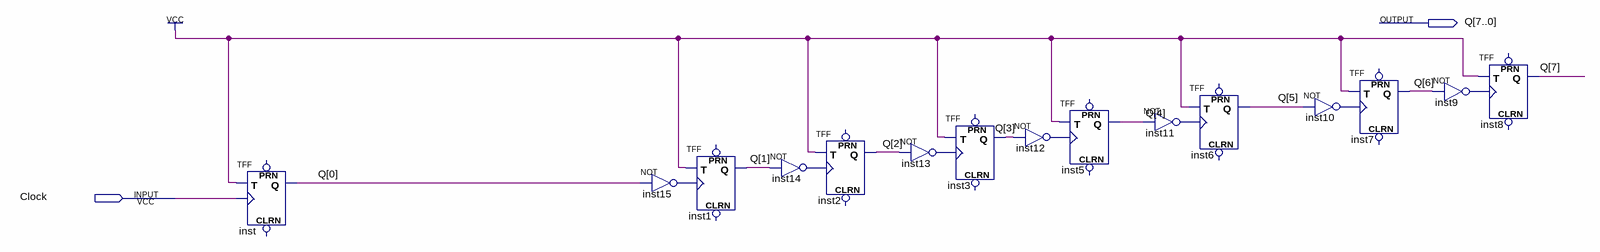
[diagram p0: schematic sheet]
// Quartus schematic ClockCounter8.bdf as structural Verilog: 15 symbols, 2 pins
module ClockCounter8 (
  input  Clock,
  output [7:0] Q
);

  wire inst9_out, inst10_out, inst11_out, inst12_out, inst13_out, inst14_out, inst15_out;

  TFF inst (.T(1'b1), .CLK(Clock), .Q(Q[0]));  // open: PRN, CLRN
  not inst15 (inst15_out, Q[0]);
  TFF inst1 (.T(1'b1), .CLK(inst15_out), .Q(Q[1]));  // open: PRN, CLRN
  not inst14 (inst14_out, Q[1]);
  TFF inst2 (.T(1'b1), .CLK(inst14_out), .Q(Q[2]));  // open: PRN, CLRN
  not inst13 (inst13_out, Q[2]);
  TFF inst3 (.T(1'b1), .CLK(inst13_out), .Q(Q[3]));  // open: PRN, CLRN
  not inst12 (inst12_out, Q[3]);
  TFF inst5 (.T(1'b1), .CLK(inst12_out), .Q(Q[4]));  // open: PRN, CLRN
  not inst11 (inst11_out, Q[4]);
  TFF inst6 (.T(1'b1), .CLK(inst11_out), .Q(Q[5]));  // open: PRN, CLRN
  TFF inst7 (.T(1'b1), .CLK(inst10_out), .Q(Q[6]));  // open: PRN, CLRN
  not inst10 (inst10_out, Q[5]);
  not inst9 (inst9_out, Q[6]);
  TFF inst8 (.T(1'b1), .CLK(inst9_out), .Q(Q[7]));  // open: PRN, CLRN
endmodule
